# Altium schematic sheet IC_Schema.SchDoc: ESP32 Breakout IC
size A3; Date: 24-2-2023; DrawnBy: Daan Heetkamp; Engineer: Daan Heetkamp; Revision: 1; SheetNumber: 1; SheetTotal: 3
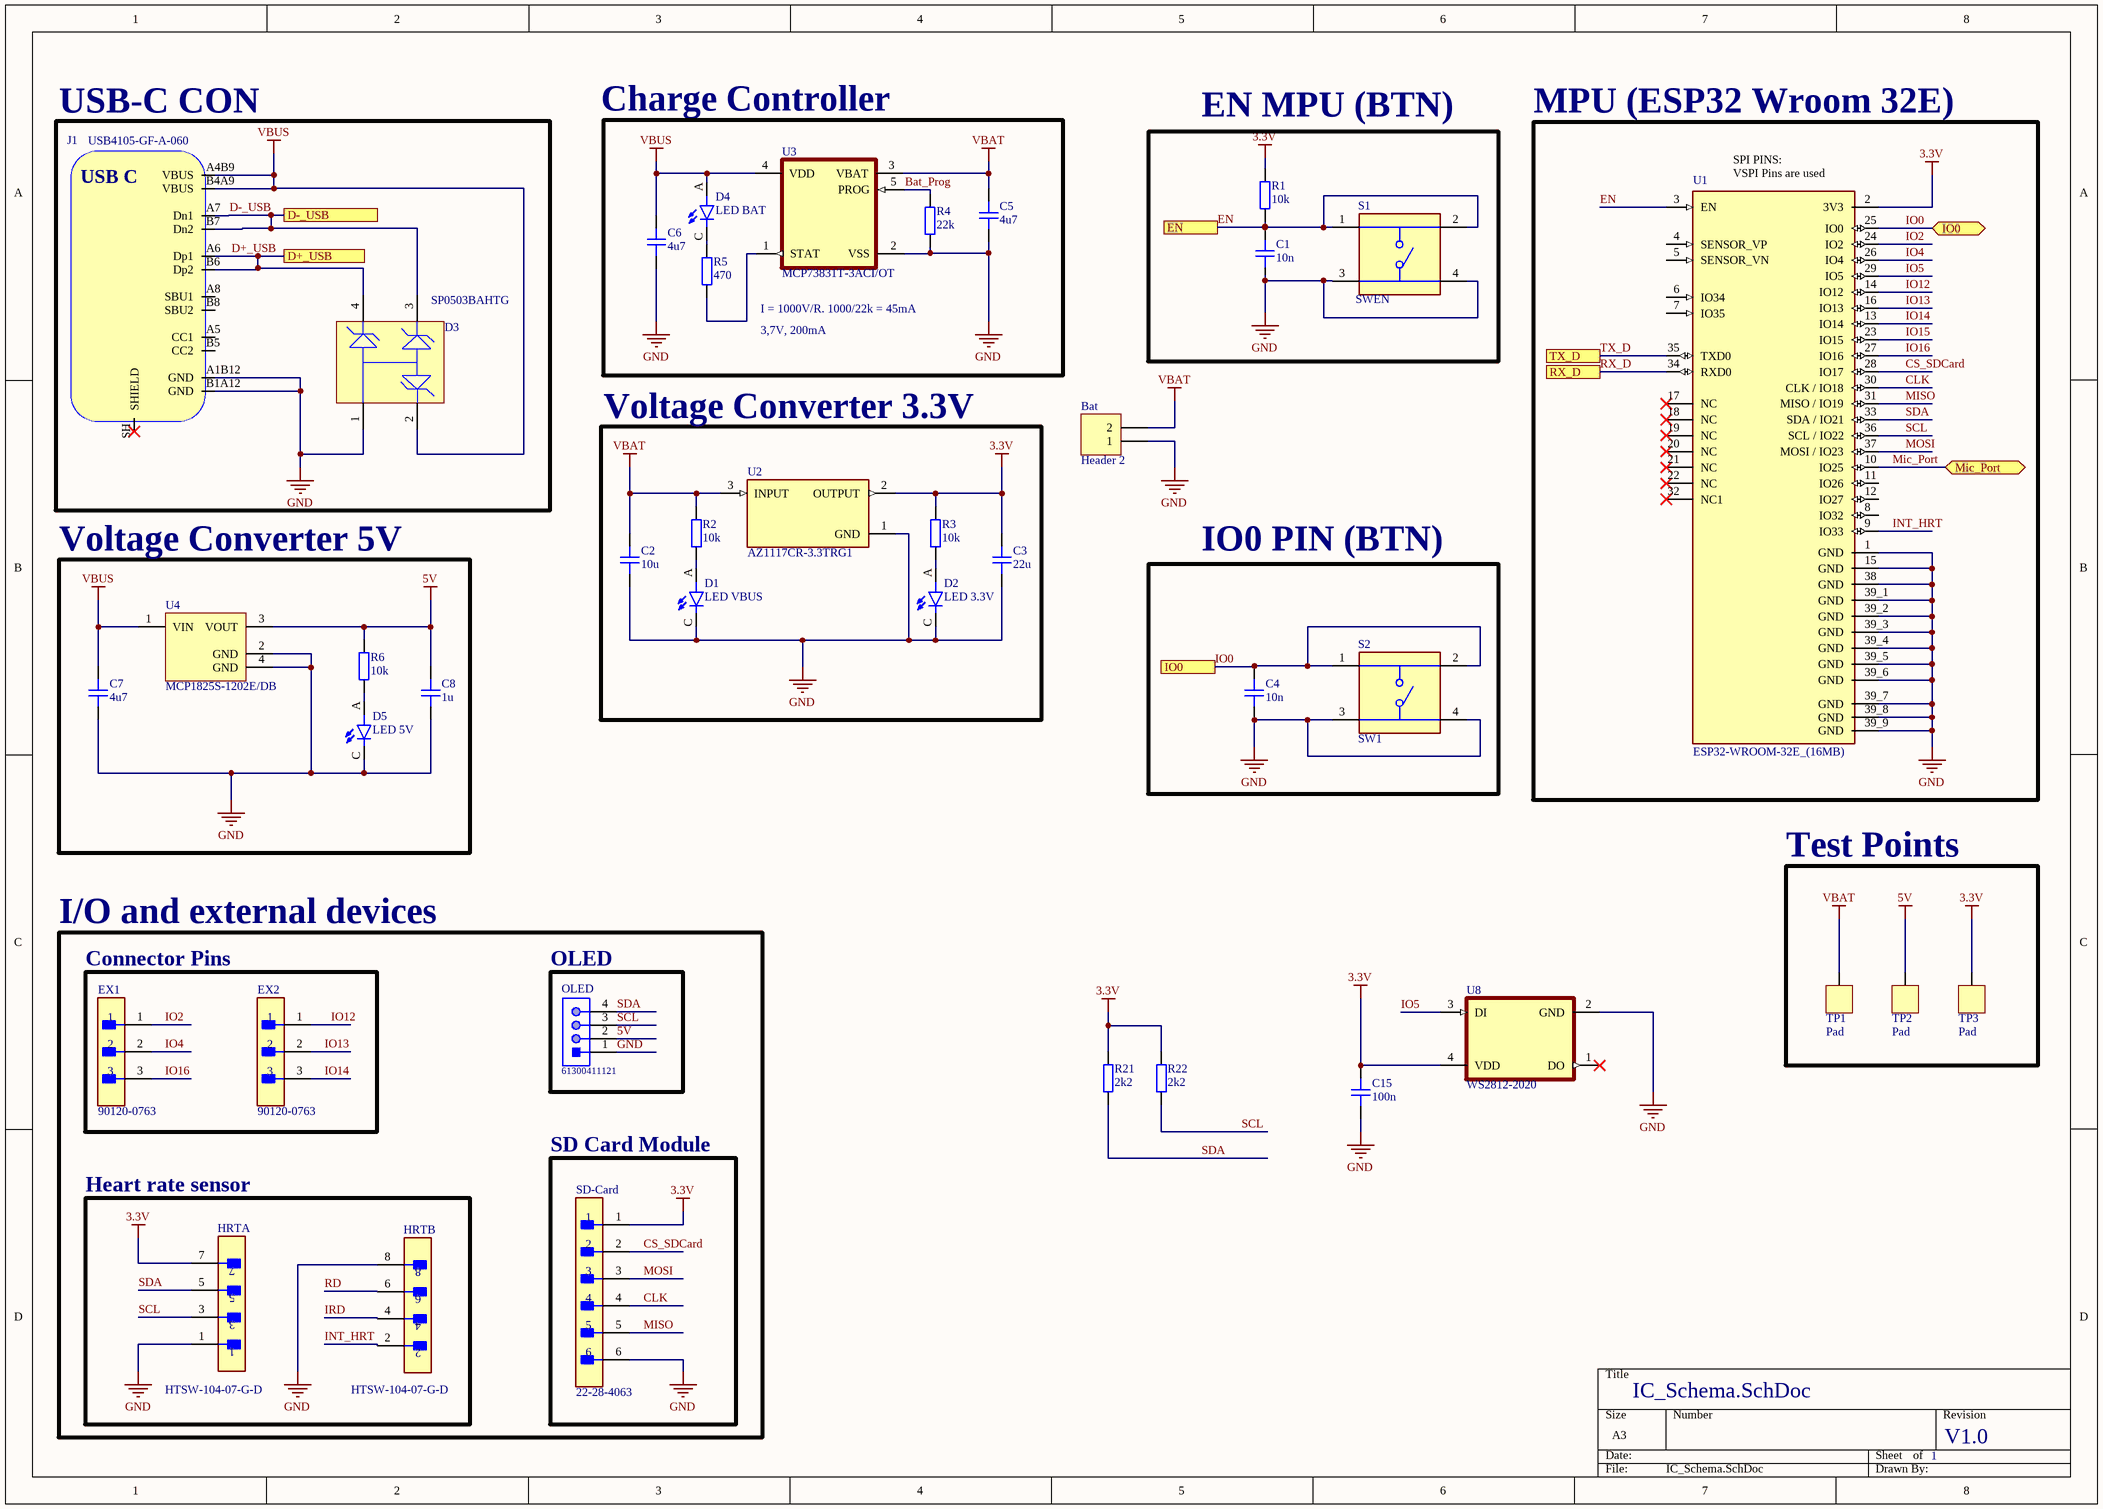
[diagram p0: IC_Schema.SchDoc]

## Parts
Bat  Header 2  [HDR1X2]
C1  10n  [CAP_1206]
C2  10u  [CAP_1206]
C3  22u  [CAP_1206]
C4  10n  [CAP_1206]
C5  4u7  [CAP_1206]
C6  4u7  [CAP_1206]
C7  4u7  [CAP_1206]
C8  1u  [CAP_1206]
C15  100n  [CAP_1206]
D1  LED VBUS  [LED_1206]
D2  LED 3.3V  [LED_1206]
D3  SP0503BAHTG  [LFUS-SOT143-4_V]
D4  LED BAT  [LED_1206]
D5  LED 5V  [LED_1206]
EX1  90120-0763  [FP-90120-0763-MFG]
EX2  90120-0763  [FP-90120-0763-MFG]
HRT  HTSW-104-07-G-D  [FP-HTSW-104-07-G-D-MFG]  (parts A,B of 2)
J1  USB4105-GF-A-060  [USB4105-GF-A-060]
OLED  61300411121  [61300411121]
R1  10k  [RES_1206]
R2  10k  [RES_1206]
R3  10k  [RES_1206]
R4  22k  [RES_1206]
R5  470  [RES_1206]
R6  10k  [RES_1206]
R21  2k2  [RES_1206]
R22  2k2  [RES_1206]
S1  SWEN  [Switch/Button 4 Pin Through Hole]
S2  SW1  [Switch/Button 4 Pin Through Hole]
SD-Card  22-28-4063  [FP-22-28-4063-MFG]
TP1  Pad  [PAD_SQ_2MM]
TP2  Pad  [PAD_SQ_2MM]
TP3  Pad  [PAD_SQ_2MM]
U1  ESP32-WROOM-32E_(16MB)  [XCVR_ESP32-WROOM-32E_(16MB)]
U2  AZ1117CR-3.3TRG1  [FP-SOT89-MFG]
U3  MCP73831T-3ACI/OT  [SOT95P270X145-5N]
U4  MCP1825S-1202E/DB  [SOT-223-DB3_N]
U8  WS2812-2020  [LED_WS2812-2020]

## Blocks framed on the sheet
USB-C CON: D3 J1
Charge Controller: C5 C6 D4 R4 R5 U3
MPU (ESP32 Wroom 32E): U1
EN MPU (BTN): C1 R1 S1
Voltage Converter 3.3V: C2 C3 D1 D2 R2 R3 U2
Voltage Converter 5V: C7 C8 D5 R6 U4
IO0 PIN (BTN): C4 S2
Test Points: TP1-TP3
Connector Pins: EX1 EX2
OLED: OLED
Heart rate sensor: HRT
SD Card Module: SD-Card

## Ports
D+_USB (see IC_Programmers[3A], IC_Programmers[7A]), D-_USB (see IC_Programmers[3A], IC_Programmers[7A]), EN (see IC_Programmers[6C], IC_Programmers[8B]), IO0 (bidir, see IC_Programmers[7B], IC_Programmers[8C], IC_Schema[5B]), IO0 (see IC_Programmers[7B], IC_Programmers[8C], IC_Schema[8A]), Mic_Port (bidir, see Microphone PreAmp[3B]), RX_D (see IC_Programmers[2A], IC_Programmers[5A]), TX_D (see IC_Programmers[2A], IC_Programmers[5A])

## Nets
3.3V: C3.2 C15.2 HRT.7 R1.1 R3.2 R21.1 R22.1 SD-Card.1 TP3.1 U1.2(3V3) U2.2(OUTPUT) U8.4(VDD)
5V: C8.2 OLED.2 R6.2 TP2.1 U4.3(VOUT)
GND: Bat.1 C1.1 C2.1 C3.1 C4.1 C5.1 C6.1 C7.1 C8.1 C15.1 D1.C D2.C D3.1 D5.C HRT.1 HRT.8 J1.A1B12(GND) J1.B1A12(GND) OLED.1 R4.1 S1.3 S1.4 S2.3 S2.4 SD-Card.6 U1.1(GND) U1.15(GND) U1.38(GND) U1.39_1(GND) U1.39_2(GND) U1.39_3(GND) U1.39_4(GND) U1.39_5(GND) U1.39_6(GND) U1.39_7(GND) U1.39_8(GND) U1.39_9(GND) U2.1(GND) U3.2(VSS) U4.2(GND) U4.4(GND) U8.2(GND)
VBAT: Bat.2 C2.2 C5.2 R2.2 TP1.1 U2.3(INPUT) U3.3(VBAT)
VBUS: C6.2 C7.2 D3.2 D4.A J1.A4B9(VBUS) J1.B4A9(VBUS) U3.4(VDD) U4.1(VIN)
Bat_Prog: R4.2 U3.5(PROG)
CLK: SD-Card.4 U1.30(CLK_/_IO18)
CS_SDCard: SD-Card.2 U1.28(IO17)
D+_USB: D3.4 J1.A6(Dp1) J1.B6(Dp2) ; port D+_USB
D-_USB: D3.3 J1.A7(Dn1) J1.B7(Dn2) ; port D-_USB
EN: C1.2 R1.2 S1.1 S1.2 U1.3(EN) ; port EN
INT_HRT: HRT.2 U1.9(IO33)
IO0: C4.2 S2.1 S2.2 U1.25(IO0) ; port IO0
IO2: EX1.1 U1.24(IO2)
IO4: EX1.2 U1.26(IO4)
IO5: U1.29(IO5) U8.3(DI)
IO12: EX2.1 U1.14(IO12)
IO13: EX2.2 U1.16(IO13)
IO14: EX2.3 U1.13(IO14)
IO15: U1.23(IO15)
IO16: EX1.3 U1.27(IO16)
IRD: HRT.4
Mic_Port: U1.10(IO25) ; port Mic_Port
MISO: SD-Card.5 U1.31(MISO_/_IO19)
MOSI: SD-Card.3 U1.37(MOSI_/_IO23)
RD: HRT.6
RX_D: U1.34(RXD0) ; port RX_D
SCL: HRT.3 OLED.3 R22.2 U1.36(SCL_/_IO22)
SDA: HRT.5 OLED.4 R21.2 U1.33(SDA_/_IO21)
TX_D: U1.35(TXD0) ; port TX_D
NetD1_A: D1.A R2.1
NetD2_A: D2.A R3.1
NetD4_C: D4.C R5.2
NetD5_A: D5.A R6.1
NetR5_1: R5.1 U3.1(STAT)

Not connected (* = marked no-connect by the designer): J1 A5(CC1) A8(SBU1) B5(CC2) B8(SBU2) SH(SHIELD)*; U1 4(SENSOR_VP) 5(SENSOR_VN) 6(IO34) 7(IO35) 8(IO32) 11(IO26) 12(IO27) 17(NC)* 18(NC)* 19(NC)* 20(NC)* 21(NC)* 22(NC)* 32(NC1)*; U8 1(DO)*

## Notes on the sheet
- (near U1) SPI PINS:
  VSPI Pins are used
- I = 1000V/R. 1000/22k = 45mA
- 3,7V, 200mA
- I/O and external devices
- V1.0
- (in symbol USB4105-GF-A-060) USB C

## Library data of the parts
Bat = Header 2: Header, 2-Pin; LatestRevisionDate: 17-Jul-2002; LatestRevisionNote: Re-released for DXP Platform.; Publisher: Altium Limited
C1-C8 C15 = CAP_1206_50V: Capacitor SMD 1206 50V
D1 D2 D4 D5 = LED - 1206: Yellow 587nm LED Indication - Discrete 2V 1206 _3216 Metric_; MF: Lite-On Inc.; MP: LTST-C230KSKT; Value: *; SnapEDA_Link: https://www.snapeda.com/parts/LTST-C230KSKT/Lite-On%20Inc./view-part/264912/?ref=snap; Availability: Unavailable; Package: 1206 Lite-On; Price: None
D3 = CMP-2000-05191-1: TVS Diode Array, 30 pF, 30 KV, -40 to 85 degC, 4-Pin SOT143, RoHS, Tape and Reel; Manufacturer: Littelfuse; Direction Type: Uni-Directional; Product Height (mm): 1.05mm; Leakage Current (Max): 0.1uA; Clamping Voltage (Max): 8V; Reverse Stand-off Voltage: 5.5(Min)V; Configuration: Triple; Working Voltage: 5.5V; Product Length (mm): 3.04mm; Working Voltage (Max): 5.5V(Min); Capacitance Value: 30pF; Rad Hardened: No; Number of Elements: 3; Product Depth (mm): 1.4mm; Operating Temperature Max Deg. C: 85C; Suppressor Type: TVS; Operating Temperature Min Deg. C: -40C; Operating Temp Range: -40Cto85C; Mounting: SurfaceMount; Package / Case: SOT-143; Datasheet Version: Dec-13; Package Type: SOT-143; Packaging: TapeandReel; Pin Count: 3+Tab; Operating Temperature Classification: Industrial; Datasheet URL: https://datasheet.ciiva.com/15143/getdatasheetpartid-116020-15143550.pdf; Manufacturer URL: http://www.littelfuse.com/; Leakage Current: 0.1uA; Mounting Style: SurfaceMount; Clamping Voltage: 8V; Polarity: Uni-Directional
EX1 EX2 = CMP-04776-000084-1: CONN HEADER VERT 3POS 2.54MM; Manufacturer: Molex; Voltage Rating: 350V; Number Of Contacts: 3; Conn Orientation: Vertical; Current Rating: 3A; Conn Gender: Male; Package: 90120-0763; ComponentLink2Description: Datasheet; Height: 5.8mm; Manufacturer Part Number: 90120-0763; Temperature Range High: +125°C; RoHS: TRUE; ComponentLink2URL: https://www.molex.com/webdocs/datasheets/pdf/en-us/0901200763_PCB_HEADERS.pdf; Device Class L2: Headers and Wire Housings; Temperature: -55°C to +125°C; Device Class L1: Connectors; Pitch: 2.54mm; Footprint Url: https://www.molex.com/pdm_docs/sd/901200763_sd.pdf; Device Class L3: unset; Temperature Range Low: -55°C; Number Of Rows: 1; Category: Conn; Lead Free: Yes; Mouser Description: Board-To-Board Connector, C-Grid III 90120 Series, Through Hole, Header, 3, 2.54 mm; Octopart: https://octopart.com/90120-0763-molex-655433; Contact Material: Gold,Nickel; Automotive: No; Digikey Description: CONN HEADER VERT 3POS 2.54MM
HRT = CMP-02766-000066-1: CONN HEADER VERT 8POS 2.54MM; Manufacturer: Samtec; Conn Orientation: Straight; Voltage Rating: 550V; Current Rating: 6.3A; Number Of Contacts: 8; Conn Gender: Male; Lead Free: Yes; ComponentLink2URL: http://suddendocs.samtec.com/prints/htsw-xxx-xx-xxx-x-xx-xx-xx-mkt.pdf; Category: Conn; Octopart: https://octopart.com/htsw-104-07-g-d-samtec-10613822; RoHS: TRUE; Device Class L2: Headers and Wire Housings; Device Class L3: unset; ComponentLink2Description: Datasheet; Number Of Rows: 2; Digikey Description: CONN HEADER VERT 8POS 2.54MM; Temperature Range Low: -55°C; Temperature: -55°C to +125°C; Automotive: No; Temperature Range High: +125°C; Footprint Url: http://suddendocs.samtec.com/prints/htsw-xxx-xx-xxx-x-xx-xx-xx-footprint.pdf; Device Class L1: Connectors; Pitch: 2.54mm; Manufacturer Part Number: HTSW-104-07-G-D; Package: HTSW-104-07-G-D; Contact Material: Gold,Nickel; Height: 8.71mm
J1 = USB4105-GF-A-060: USB Connector Type C SMT 12 Pin; Manufacturer: GCT; Manufacturer Part Number: USB4105-GF-A-060
OLED = CMP-1502-01064-1: THT Vertical Pin Header WR-PHD, Pitch 2.54 mm, Single Row, 4 pins; Manufacturer: Wurth Elektronik; Withstanding Voltage: 500VAC; Rated Current: 3A; Working Voltage: 250VAC; Pin Number: 4; Gender: Male; Contact Resistance: 20mOhm; Pitch: 2.54mm; Manufacturer URL: http://www.we-online.de; Operating Temperature: -40to105degC; Packaging: Bag; Mounting Technology: THT; Package Reference: 61300411121; Datasheet URL: https://katalog.we-online.de/em/datasheet/6130xx11121.pdf; Publisher: WurthElektronik; Part Number: 61300411121; Row Number: Single; Orientation: Vertical
R1-R6 R21 R22 = RES_1206: Resistor SMD 1206
S1 S2 = Switch/Button 4 Pin Through Hole: TS02-66-120-BK-260-LCR-D / 6 x 6 mm, 12 mm Actuator Height, 260 gf, Black, Long Crimped, Through Hole, SPST, Tactile Switch; MF: CUI Devices; SnapEDA_Link: https://www.snapeda.com/parts/TS02-66-120-BK-260-LCR-D/CUI+Devices/view-part/?ref=snap; Package: None; MP: TS02-66-120-BK-260-LCR-D; CUI_purchase_URL: https://www.cuidevices.com/product/switches/tactile-switches/ts02-series?utm_source=snapeda.com&utm_medium=referral&utm_campaign=snapedaBOM; Value: *; Check_prices: https://www.snapeda.com/parts/TS02-66-120-BK-260-LCR-D/CUI+Devices/view-part/?ref=eda; Price: None; Purchase-URL: https://pricing.snapeda.com/search/part/TS02-66-120-BK-260-LCR-D/?ref=eda; Availability: In Stock
SD-Card = CMP-04776-000885-1: CONN HEADER VERT 6POS 2.54MM; Number of Circuits: 6; Voltage Rating (DC): 250V; Connector Type: Male Pin; Contact Resistance: 20mR; Glow Wire Compliant: Non-compliant; Gender: Male; Current Rating: 4A; Max Voltage Rating (DC): 250.25kV; Series: KK® 42375; Termination: Solder; Orientation: Straight; Max Operating Temperature: 75°C; Min Operating Temperature: 0°C; Mount: Through Hole; Depth: 2.49mm; Contact Material: Brass; Number of Positions: 6; Contact Mating Length: 0.24inch; Number of Rows: 1; Housing Color: Black; Max Voltage Rating (AC): 250V; Housing Material: Thermoplastic; Packaging: Bulk; Contact Plating: Gold; Contact Type: Male Pin; Package Quantity: 1; Number of Contacts: 6; Voltage Rating: 250V; Lead Free: Lead Free; RoHS Compliant: Yes; Pitch: 2.54mm; Color: Black; Flammability Rating: UL94 V-0; Radiation Hardening: No
TP1-TP3 = PAD_SQ_2MM: Test Point Square 2mm
U1 = ESP32-WROOM-32E_(16MB): Bluetooth, WiFi 802.11b/g/n, Bluetooth v4.2 +EDR, Class 1, 2 and 3 Transceiver Module 2.4GHz ~ 2.5GHz Integrated, Trace Surface Mount; MP: ESP32-WROOM-32E (16MB); MF: Espressif Systems; Price: None; Availability: Not in stock; Package: None; Value: *; SnapEDA_Link: https://www.snapeda.com/parts/ESP32-WROOM-32E%20(16MB)/Espressif+Systems/view-part/?ref=snap; Check_prices: https://www.snapeda.com/parts/ESP32-WROOM-32E%20(16MB)/Espressif+Systems/view-part/?ref=eda
U2 = CMP-12756-000007-1: IC REG LINEAR 3.3V 800MA SOT89; Manufacturer: Diodes Inc.; Nominal Supply Current: 4mA; Output Type: Fixed; Accuracy Percentage: 1%; Max Junction Temp: +125°C; Max Supply Voltage: 15V; Number Of Outputs: 1; Output Current: 1.35A; Dropout Voltage: 1.2V; Device Class L1: Integrated Circuits (ICs); ComponentLink2URL: https://www.diodes.com/assets/Datasheets/AZ1117C.pdf; Temperature Range High: +125°C; Octopart: https://octopart.com/az1117cr-3.3trg1-diodes+inc.-30954805; Output Voltage: 3.3V; Automotive: No; RoHS: TRUE; Temperature Range Low: -20°C; Package: SOT89; Height: 1.6mm; Mouser Description: DiodesZetex AZ1117CR-3.3TRG1, LDO Regulator, 800mA, 3.3 V, ±1% 3-Pin, SOT-89; Manufacturer Part Number: AZ1117CR-3.3TRG1; ComponentLink2Description: Datasheet; Device Class L2: Power Management ICs; Lead Free: Yes; Device Class L3: Voltage Regulators - Linear; Category: IC; Temperature: -20°C to +125°C; Footprint Url: https://www.diodes.com/assets/Package-Files/SOT89.pdf; Digikey Description: IC REG LINEAR 3.3V 800MA SOT89
U3 = MCP73831T-3ACI/OT: Charger IC Lithium Ion/Polymer SOT-23-5; MF: Microchip; Package: SOT-23-5 Microchip; MP: MCP73831T-3ACI/OT; SnapEDA_Link: https://www.snapeda.com/parts/MCP73831T-3ACI/OT/Microchip/view-part/1099789/?ref=snap; Mouser-Purchase-URL: https://snapeda.com/shop?store=Mouser&id=1099789; Value: *; Arrow_Electronics-Purchase-URL: https://snapeda.com/shop?store=Arrow+Electronics&id=1099789
U4 = CMP-0136-00465-1: 500 mA, Low Voltage, Low Quiescent Current LDO Regulator, 3-Pin SOT-223, Extended Temperature; PackageVersion: revBB, Aug-2009; PackageDescription: 3-Lead Plastic Small Outline Transistor (DB) [SOT-223]; DatasheetVersion: revB, Feb-2008; PackageReference: SOT-223-DB3
U8 = WS2812-2020: Intelligent control LED integrated light source; Price: None; Package: None; Availability: Unavailable; MP: WS2812-2020; Value: *